# Altium schematic sheet CONNECTOR.SchDoc
size 393 x 281 mm; SheetNumber: 6; SheetTotal: 6
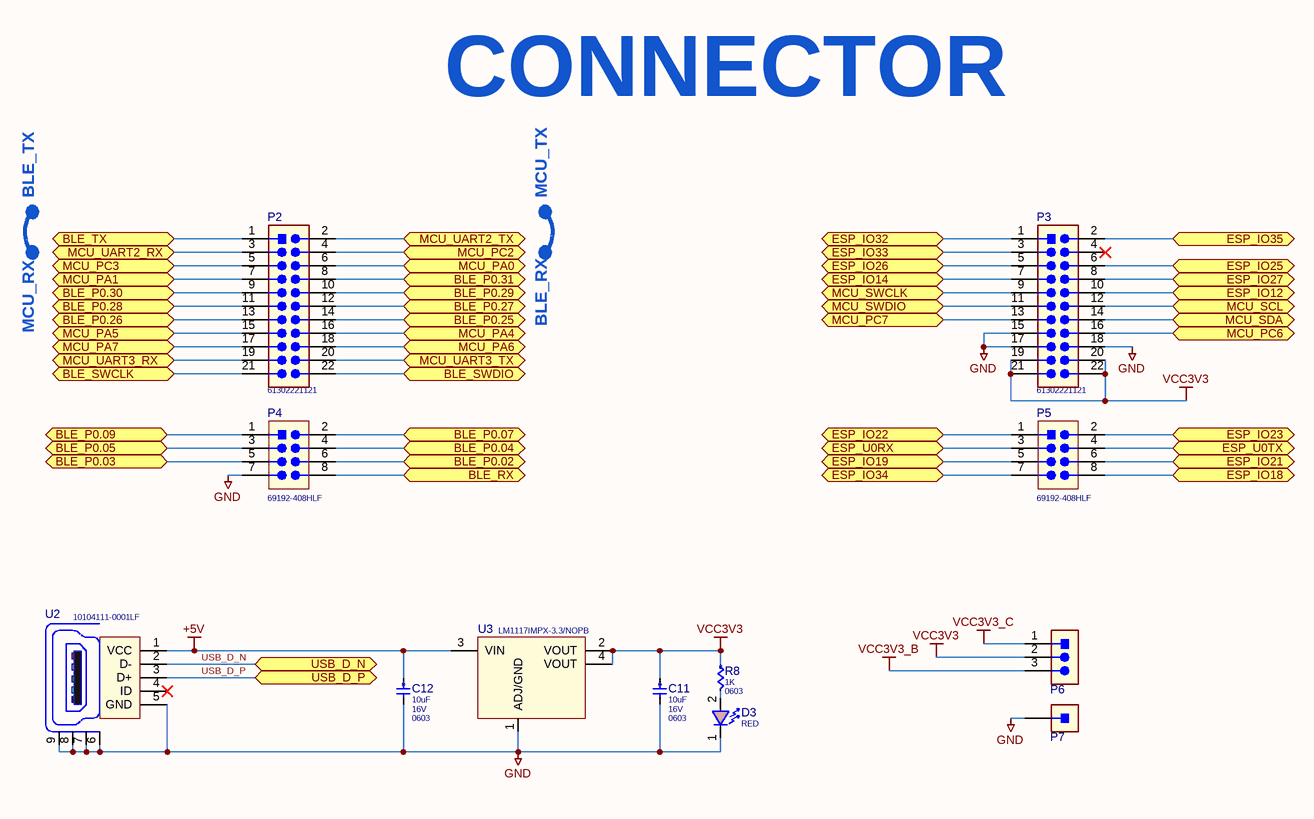
[diagram p0: CONNECTOR.SchDoc]

## Parts
C11  value 10uF  VOLTAGE: 16V  PACK: 0603  [C0603]  (hidden comment: 10uF 16V 0603)
C12  value 10uF  VOLTAGE: 16V  PACK: 0603  [C0603]  (hidden comment: 10uF 16V 0603)
D3  COLOR: RED  [LED0805_RED]  (hidden comment: LH R974-LP-1)
P2  61302221121  [CON_22_2.54]
P3  61302221121  [CON_22_2.54]
P4  69192-408HLF  [CON_2x4_2.54P]
P5  69192-408HLF  [CON_2x4_2.54P]
P6  CON3  [CON_3_2.54]  (value not drawn)  (no BOM)
P7  PAD_2.54  [CONN_1]  (value not drawn)
R8  value 1K  PACK: 0603  [R0603]  (hidden comment: 1K 0603)
U2  10104111-0001LF  [USB-MICRO-AB]
U3  LM1117IMPX-3.3/NOPB  [SOT-223-4]

## Ports
BLE_P0.02 (bidir), BLE_P0.03 (bidir), BLE_P0.04 (bidir), BLE_P0.05 (bidir), BLE_P0.07 (bidir), BLE_P0.09 (bidir), BLE_P0.25 (bidir), BLE_P0.26 (bidir), BLE_P0.27 (bidir), BLE_P0.28 (bidir), BLE_P0.29 (bidir), BLE_P0.30 (bidir), BLE_P0.31 (bidir), BLE_RX (bidir), BLE_SWCLK (bidir), BLE_SWDIO (bidir), BLE_TX (bidir), ESP_IO12 (bidir), ESP_IO14 (bidir), ESP_IO18 (bidir), ESP_IO19 (bidir), ESP_IO21 (bidir), ESP_IO22 (bidir), ESP_IO23 (bidir), ESP_IO25 (bidir), ESP_IO26 (bidir), ESP_IO27 (bidir), ESP_IO32 (bidir), ESP_IO33 (bidir), ESP_IO34 (bidir), ESP_IO35 (bidir), ESP_U0RX (bidir), ESP_U0TX (bidir), MCU_PA0 (bidir), MCU_PA1 (bidir), MCU_PA4 (bidir), MCU_PA5 (bidir), MCU_PA6 (bidir), MCU_PA7 (bidir), MCU_PC2 (bidir), MCU_PC3 (bidir), MCU_PC6 (bidir), MCU_PC7 (bidir), MCU_SCL (bidir), MCU_SDA (bidir), MCU_SWCLK (bidir), MCU_SWDIO (bidir), MCU_UART2_RX (bidir), MCU_UART2_TX (bidir), MCU_UART3_RX (bidir), MCU_UART3_TX (bidir), USB_D_N (bidir), USB_D_P (bidir)

## Nets
+5V: C12.1 U2.1(VCC) U3.3(VIN)
GND: C11.2 C12.2 D3.1(K) P3.15 P3.17 P3.18 P4.7 P7.1 U2.5(GND) U2.6(Shield) U2.7(Shield) U2.8(Shield) U2.9(Shield) U3.1(ADJ/GND)
VCC3V3: C11.1 P3.19 P3.20 P3.21 P3.22 P6.2 R8.1 U3.2(VOUT) U3.4(VOUT)
VCC3V3_B: P6.3
VCC3V3_C: P6.1
BLE_P0.02: P4.6 ; port BLE_P0.02
BLE_P0.03: P4.5 ; port BLE_P0.03
BLE_P0.04: P4.4 ; port BLE_P0.04
BLE_P0.05: P4.3 ; port BLE_P0.05
BLE_P0.07: P4.2 ; port BLE_P0.07
BLE_P0.09: P4.1 ; port BLE_P0.09
BLE_P0.25: P2.14 ; port BLE_P0.25
BLE_P0.26: P2.13 ; port BLE_P0.26
BLE_P0.27: P2.12 ; port BLE_P0.27
BLE_P0.28: P2.11 ; port BLE_P0.28
BLE_P0.29: P2.10 ; port BLE_P0.29
BLE_P0.30: P2.9 ; port BLE_P0.30
BLE_P0.31: P2.8 ; port BLE_P0.31
BLE_RX: P4.8 ; port BLE_RX
BLE_SWCLK: P2.21 ; port BLE_SWCLK
BLE_SWDIO: P2.22 ; port BLE_SWDIO
BLE_TX: P2.1 ; port BLE_TX
ESP_IO12: P3.10 ; port ESP_IO12
ESP_IO14: P3.7 ; port ESP_IO14
ESP_IO18: P5.8 ; port ESP_IO18
ESP_IO19: P5.5 ; port ESP_IO19
ESP_IO21: P5.6 ; port ESP_IO21
ESP_IO22: P5.1 ; port ESP_IO22
ESP_IO23: P5.2 ; port ESP_IO23
ESP_IO25: P3.6 ; port ESP_IO25
ESP_IO26: P3.5 ; port ESP_IO26
ESP_IO27: P3.8 ; port ESP_IO27
ESP_IO32: P3.1 ; port ESP_IO32
ESP_IO33: P3.3 ; port ESP_IO33
ESP_IO34: P5.7 ; port ESP_IO34
ESP_IO35: P3.2 ; port ESP_IO35
ESP_U0RX: P5.3 ; port ESP_U0RX
ESP_U0TX: P5.4 ; port ESP_U0TX
MCU_PA0: P2.6 ; port MCU_PA0
MCU_PA1: P2.7 ; port MCU_PA1
MCU_PA4: P2.16 ; port MCU_PA4
MCU_PA5: P2.15 ; port MCU_PA5
MCU_PA6: P2.18 ; port MCU_PA6
MCU_PA7: P2.17 ; port MCU_PA7
MCU_PC2: P2.4 ; port MCU_PC2
MCU_PC3: P2.5 ; port MCU_PC3
MCU_PC6: P3.16 ; port MCU_PC6
MCU_PC7: P3.13 ; port MCU_PC7
MCU_SCL: P3.12 ; port MCU_SCL
MCU_SDA: P3.14 ; port MCU_SDA
MCU_SWCLK: P3.9 ; port MCU_SWCLK
MCU_SWDIO: P3.11 ; port MCU_SWDIO
MCU_UART2_RX: P2.3 ; port MCU_UART2_RX
MCU_UART2_TX: P2.2 ; port MCU_UART2_TX
MCU_UART3_RX: P2.19 ; port MCU_UART3_RX
MCU_UART3_TX: P2.20 ; port MCU_UART3_TX
USB_D_N: U2.2(D-) ; port USB_D_N
USB_D_P: U2.3(D+) ; port USB_D_P
NetD3_2: D3.2(A) R8.2

Not connected (* = marked no-connect by the designer): P3 4*; U2 4(ID)*

## Notes on the sheet
- CONNECTOR
- BLE_TX
- MCU_TX
- MCU_RX
- BLE_RX
- Title:
- Size:
- A3
- Date Modified:
- Document Number:
- Rev:
- Engineer:
- Sheet
- Of

## Library data of the parts
C11 C12 = C0603_10uF_16V_10%: CAP CER 10UF 10% 16V X5R 0603 SMD; MGR: Murata Electronics; MGR PN: GRM188R61C106KAALJ; Group: CAP CER; Line Type: SMT; Unit: PCS; TYPE: CAP; Mounting Type: SMD; PHX PN: *; PHX CODE: *; NOTE: *; SAP code: *; Part Code: *; Part Type: EP; TEMP: X5R; TOLERANCE: 10%
D3 = LED0805_RED: LED IND RED 1.8V 20mA 0805 SMD; MGR: OSRAM; Group: LED IND; Line Type: SMT; Unit: PCS; PACK: 0805; TYPE: LED; Mounting Type: SMD; PHX PN: *; PHX CODE: *; NOTE: *; SAP code: *; Part Code: *; Part Type: EP; VF(V): 1.8V; IF(mA): 20mA; MGR PN: LH R974-LP-1
P2 = CON_2x11: CON C2B 2R11C M 2.54P THR; MGR: Amphenol ICC (FCI); Group: CON C2B; Unit: PCS; ROW: 2; COL: 11; PITCH: 2.54; TYPE: CON; Line Type: THR; Mounting Type: DIP; PHX PN: *; PHX CODE: *; NOTE: *; SAP code: *; Part Code: *; Part Type: EP; M/F: M; PACK: 2.54P; MGR PN: 61302221121
P3 = CON_2x11: CON C2B 2R11C M 2.54P THR; MGR: Würth Elektronik; Group: CON C2B; Unit: PCS; ROW: 2; COL: 11; PITCH: 2.54; TYPE: CON; Line Type: THR; Mounting Type: DIP; PHX PN: *; PHX CODE: *; NOTE: *; SAP code: *; Part Code: *; Part Type: EP; M/F: M; PACK: 2.54P; MGR PN: 61302221121
P4 P5 = CON_2x4: CON C2B 2R4C M 2.54P THR; MGR: Amphenol ICC (FCI); Group: CON C2B; Unit: PCS; ROW: 2; COL: 4; PITCH: 2.54; TYPE: CON; Line Type: THR; Mounting Type: DIP; PHX PN: *; PHX CODE: *; NOTE: *; SAP code: *; Part Code: *; Part Type: EP; M/F: M; PACK: 2.54P; MGR PN: 69192-408HLF
P6 = CON3: CONNECTOR 3POS 2.54
R8 = R0603_1K_1/10W_1%: RES CHP 1K 1% 1/10W 0603 SMD; MGR: PANASONIC; MGR PN: ERJ-3EKF1001V; Group: RES CHP; Line Type: SMT; Unit: PCS; TYPE: RES; Mounting Type: SMD; PHX PN: *; PHX CODE: *; NOTE: *; SAP code: *; Part Code: *; Part Type: EP; POWER: 1/10W; TOLERANCE: 1%
U2 = CON_USB_MICRO: CON USB 2.0 MICRO AB SMD; MGR: Amphenol ICC (FCI); Group: CON USB; Line Type: SMT; PACK: USB-micro AB; Unit: PCS; M/F: M; TYPE: CON; Mounting Type: SMD; PHX PN: *; PHX CODE: *; NOTE: *; SAP code: *; Part Code: *; Part Type: EP; ROW: *; COL: *; PITCH: *; MGR PN: 10104111-0001LF
U3 = IC_LM1117IMPX-3.3/NOPB: ICS PMI VREG 3.3V 800mA SOT-223-4 SMD; MGR: MPS; Group: ICS PMI; Line Type: SMT; Unit: PCS; TYPE: ICS; PACK: SOT-223-4; Mounting Type: SMD; PHX PN: *; PHX CODE: *; NOTE: *; SAP code: *; Part Code: *; Part Type: EP; I-OUT (MAX): 800mA; VOLTAGE: *; MGR PN: LM1117IMPX-3.3/NOPB